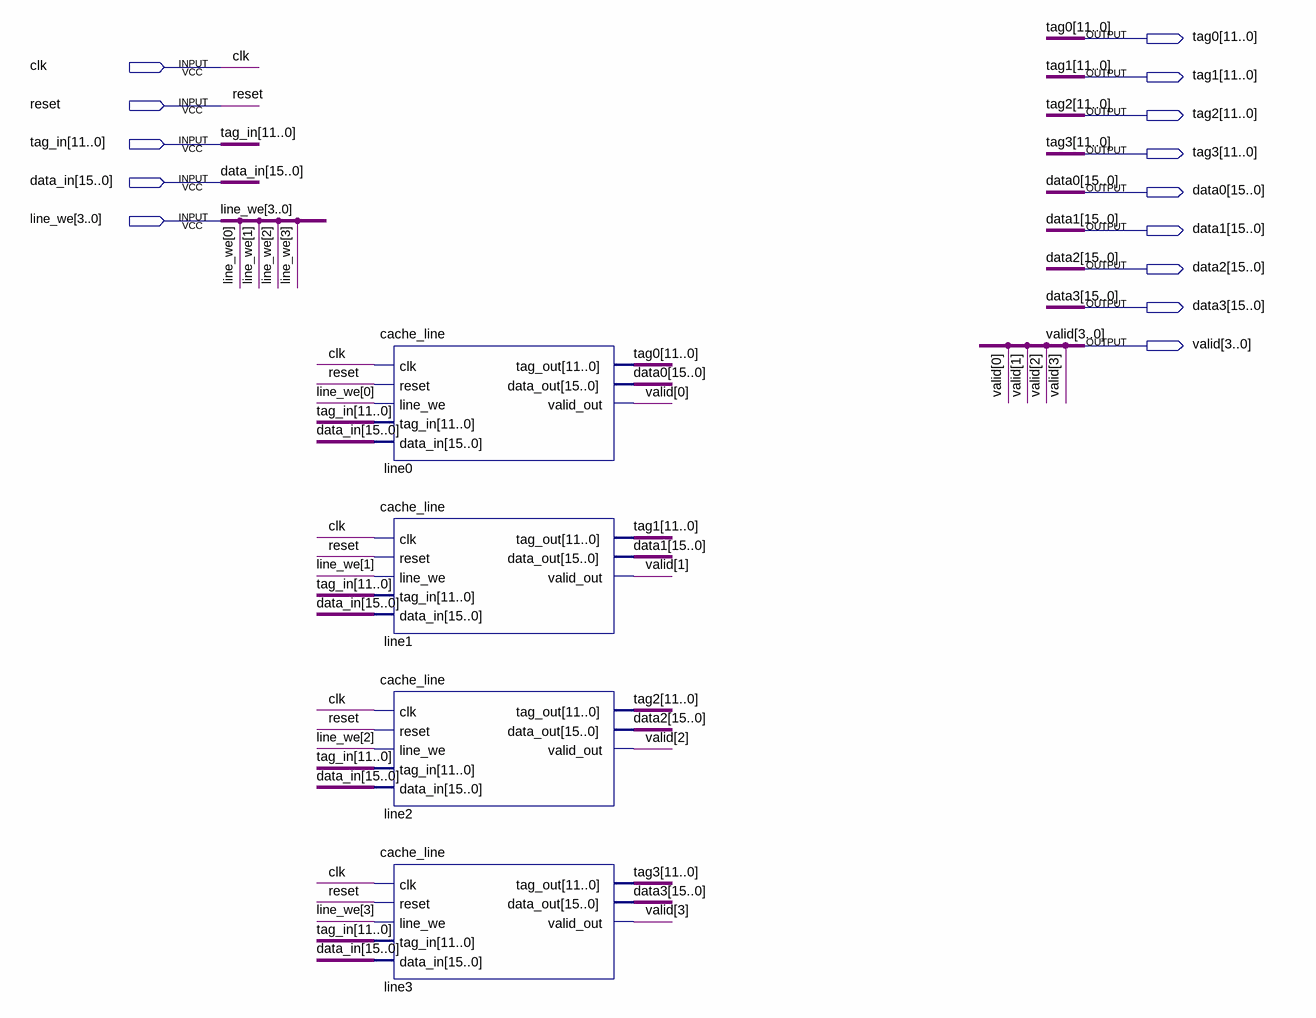
[diagram p0: schematic sheet]
// Quartus schematic cache_array_4x4B.bdf as structural Verilog: 4 symbols, 14 pins
module cache_array_4x4B (
  input  clk,
  input  reset,
  input  [11:0] tag_in,
  input  [15:0] data_in,
  input  [3:0] line_we,
  output [11:0] tag0,
  output [11:0] tag1,
  output [11:0] tag2,
  output [11:0] tag3,
  output [15:0] data0,
  output [15:0] data1,
  output [15:0] data2,
  output [15:0] data3,
  output [3:0] valid
);

  cache_line line0 (
    .clk(clk), .reset(reset), .line_we(line_we[0]), .tag_in(tag_in), .data_in(data_in), .tag_out(tag0),
    .data_out(data0), .valid_out(valid[0]));
  cache_line line1 (
    .clk(clk), .reset(reset), .line_we(line_we[1]), .tag_in(tag_in), .data_in(data_in), .tag_out(tag1),
    .data_out(data1), .valid_out(valid[1]));
  cache_line line2 (
    .clk(clk), .reset(reset), .line_we(line_we[2]), .tag_in(tag_in), .data_in(data_in), .tag_out(tag2),
    .data_out(data2), .valid_out(valid[2]));
  cache_line line3 (
    .clk(clk), .reset(reset), .line_we(line_we[3]), .tag_in(tag_in), .data_in(data_in), .tag_out(tag3),
    .data_out(data3), .valid_out(valid[3]));
endmodule
